# EAGLE schematic canSlaveV03_16s (EAGLE 6.3)

## Sheet 1 of 5
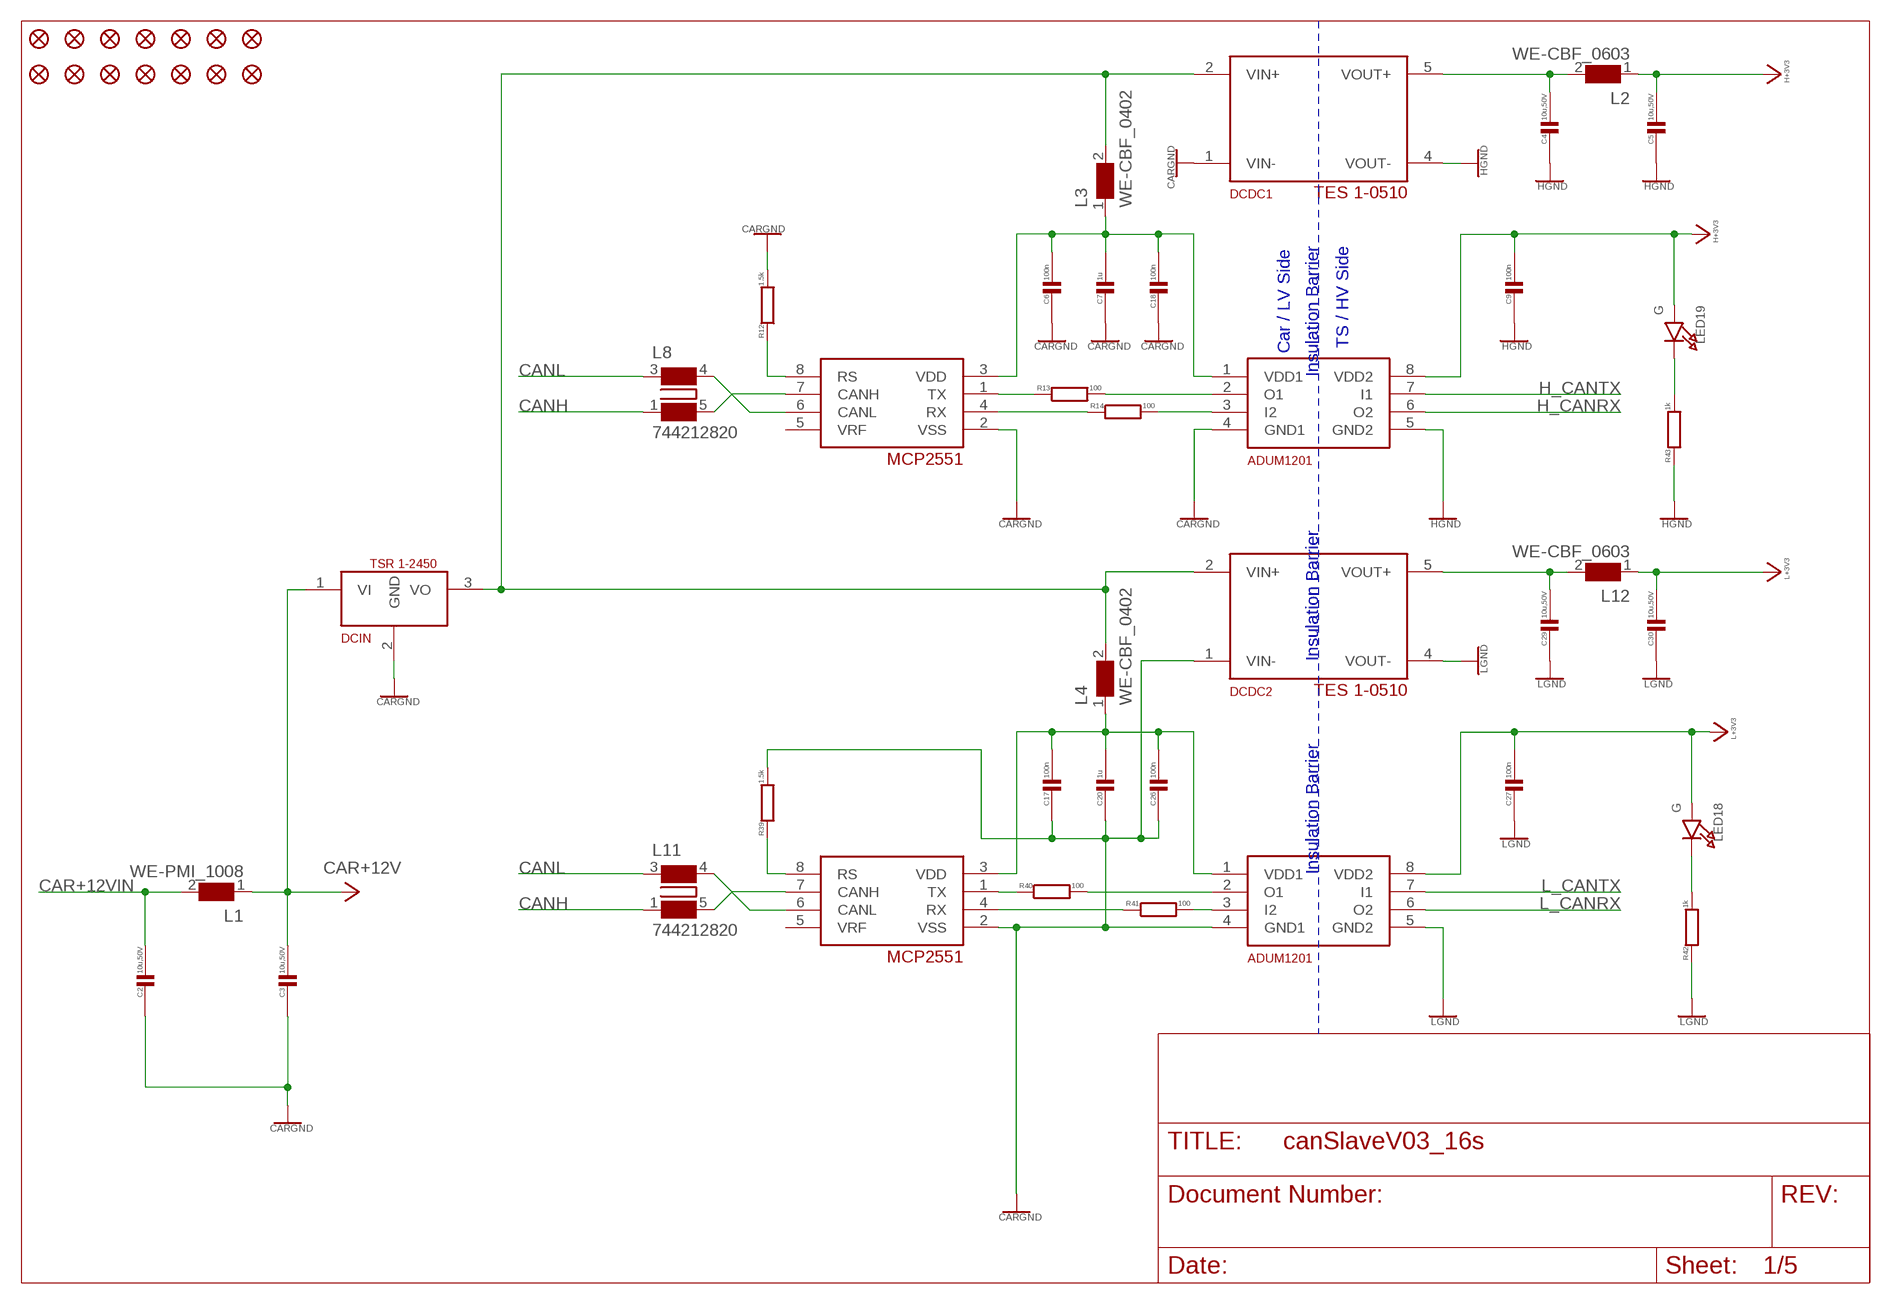
[diagram p0: schematic, sheet 1]

### Parts
C2  10u,50V  C0603  [C0603]
C3  10u,50V  C0603  [C0603]
C4  10u,50V  C0603  [C0603]
C5  10u,50V  C0603  [C0603]
C6  100n  C0402  [C0402]
C7  1u  C0402  [C0402]
C9  100n  C0402  [C0402]
C17  100n  C0402  [C0402]
C18  100n  C0402  [C0402]
C20  1u  C0402  [C0402]
C26  100n  C0402  [C0402]
C27  100n  C0402  [C0402]
C29  10u,50V  C0603  [C0603]
C30  10u,50V  C0603  [C0603]
DCDC1  TES 1-0510  ISFXXXXA  [ISF]
DCDC2  TES 1-0510  ISFXXXXA  [ISF]
DCIN  TSR 1-2450  TSR1  [TSR1]
FID1  FIDUCIAL""  [FIDUCIAL_1MM]
FID2  FIDUCIAL""  [FIDUCIAL_1MM]
FID3  FIDUCIAL""  [FIDUCIAL_1MM]
FID4  FIDUCIAL""  [FIDUCIAL_1MM]
FID5  FIDUCIAL""  [FIDUCIAL_1MM]
FID6  FIDUCIAL""  [FIDUCIAL_1MM]
FID7  FIDUCIAL""  [FIDUCIAL_1MM]
FID8  FIDUCIAL""  [FIDUCIAL_1MM]
FID9  FIDUCIAL""  [FIDUCIAL_1MM]
FID10  FIDUCIAL""  [FIDUCIAL_1MM]
FID11  FIDUCIAL""  [FIDUCIAL_1MM]
FID12  FIDUCIAL""  [FIDUCIAL_1MM]
FID13  FIDUCIAL""  [FIDUCIAL_1MM]
FID14  FIDUCIAL""  [FIDUCIAL_1MM]
IC3  ADUM1201  [SO-8]
IC4  MCP2551  [SO-8]
IC5  MCP2551  [SO-8]
IC6  ADUM1201  [SO-8]
L1  WE-PMI_1008  [WE-PMI_1008]
L2  WE-CBF_0603  [0603]
L3  WE-CBF_0402  [0402]
L4  WE-CBF_0402  [0402]
L8  744212820  WE-SL1  [WE-SL1]
L11  744212820  WE-SL1  [WE-SL1]
L12  WE-CBF_0603  [0603]
LED18  G  LED0603  [CHIPLED_0603]
LED19  G  LED0603  [CHIPLED_0603]
R12  1.5k  R0402  [R0402]
R13  100  R0402  [R0402]
R14  100  R0402  [R0402]
R39  1.5k  R0402  [R0402]
R40  100  R0402  [R0402]
R41  100  R0402  [R0402]
R42  1k  R0603  [R0603]
R43  1k  R0603  [R0603]

### Nets
+3V3DCOUT: C4.1 DCDC1.5(VOUT+) L2.2
+3V3DCOUT1: C29.1 DCDC2.5(VOUT+) L12.2
CANH: L8.1 L11.1 ; also sheet 5
CANL: L8.3 L11.3 ; also sheet 5
CAR+5V: DCDC1.2(VIN+) DCDC2.2(VIN+) DCIN.3(VO) L3.2 L4.2
CAR+5V_H: C6.1 C7.1 C18.1 IC3.1(VDD1) IC4.3(VDD) L3.1
CAR+5V_LFILT: C17.1 C20.1 C26.1 IC5.3(VDD) IC6.1(VDD1) L4.1
CAR+12V: C3.1 DCIN.1(VI) L1.1
CAR+12VIN: C2.1 L1.2 ; also sheet 5
CARGND: C2.2 C3.2 C6.2 C7.2 C17.2 C18.2 C20.2 C26.2 DCDC1.1(VIN-) DCDC2.1(VIN-) DCIN.2(GND) IC3.4(GND1) IC4.2(VSS) IC5.2(VSS) IC6.4(GND1) R12.2 R39.2 ; also sheet 5
H+3V3: C5.1 C9.1 IC3.8(VDD2) L2.1 LED19.A ; also sheet 2,3,5
H_CANRX: IC3.6(O2) ; also sheet 2
H_CANTX: IC3.7(I1) ; also sheet 2
H_CAR_CANRX: IC3.3(I2) R14.2
H_CAR_CANRX_T: IC4.4(RX) R14.1
H_CAR_CANTX: IC3.2(O1) R13.2
H_CAR_CANTX_T: IC4.1(TX) R13.1
HCANHL: IC4.7(CANH) L8.5
HCANLL: IC4.6(CANL) L8.4
HGND: C4.2 C5.2 C9.2 DCDC1.4(VOUT-) IC3.5(GND2) R43.1 ; also sheet 2,3,5
L+3V3: C27.1 C30.1 IC6.8(VDD2) L12.1 LED18.A ; also sheet 2,3,5
L_CANRX: IC6.6(O2) ; also sheet 2
L_CANTX: IC6.7(I1) ; also sheet 2
L_CAR_CANRX: IC6.3(I2) R41.2
L_CAR_CANRX_T: IC5.4(RX) R41.1
L_CAR_CANTX: IC6.2(O1) R40.2
L_CAR_CANTX_T: IC5.1(TX) R40.1
LCANHL: IC5.7(CANH) L11.5
LCANLL: IC5.6(CANL) L11.4
LGND: C27.2 C29.2 C30.2 DCDC2.4(VOUT-) IC6.5(GND2) R42.1 ; also sheet 2,3,5
N$1: LED19.C R43.2
N$2: LED18.C R42.2
RS: IC4.8(RS) R12.1
RS1: IC5.8(RS) R39.1
Unconnected: IC4.5(VRF) IC5.5(VRF)

### Buses
B$1

### Notes on the sheet
- TS / HV Side
- Car / LV Side
- Insulation Barrier
- Insulation Barrier
- Insulation Barrier

## Sheet 2 of 5
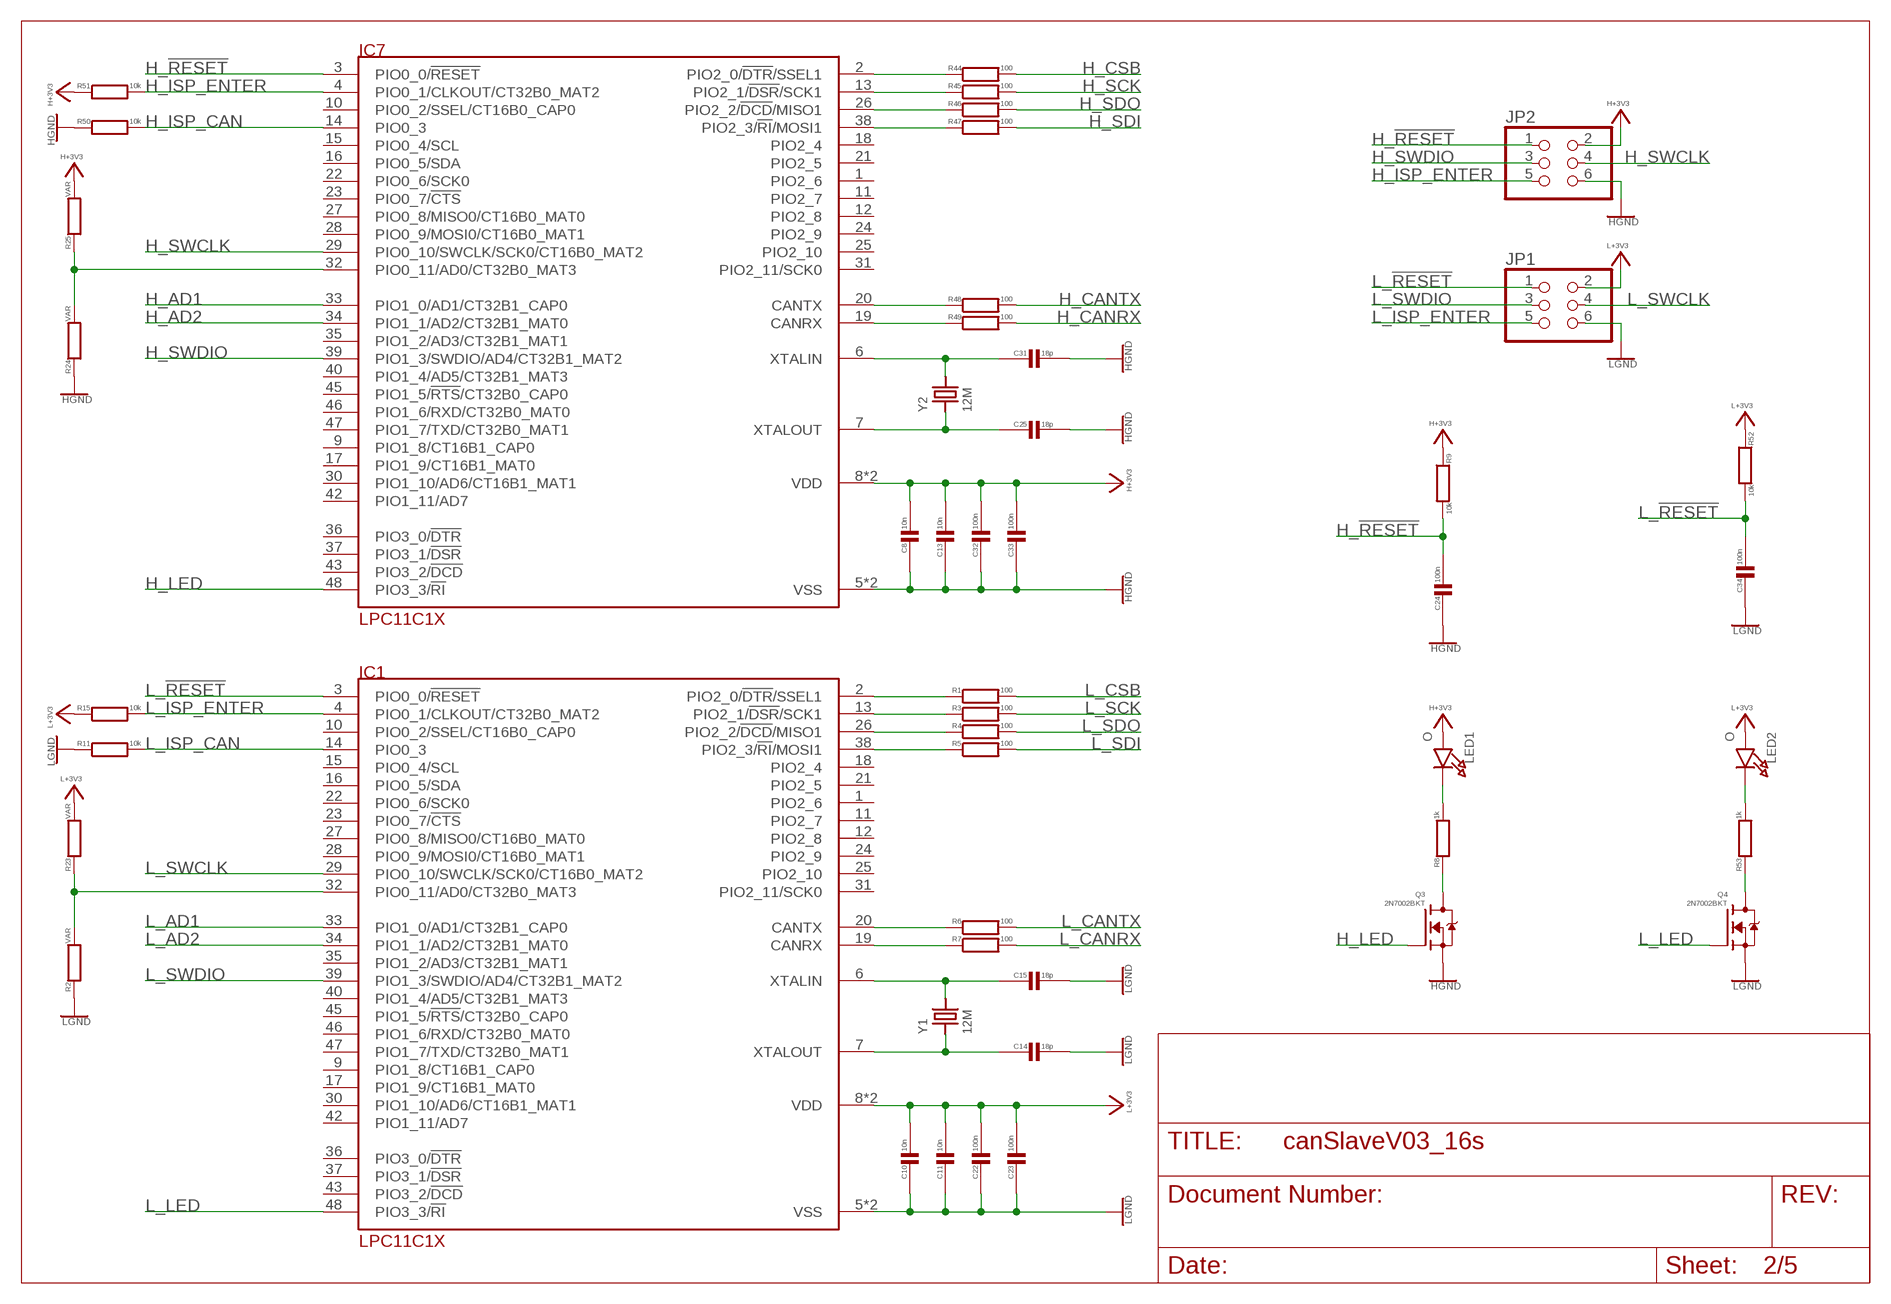
[diagram p1: schematic, sheet 2]

### Parts
C8  10n  C0402  [C0402]
C10  10n  C0402  [C0402]
C11  10n  C0402  [C0402]
C13  10n  C0402  [C0402]
C14  18p  C0402  [C0402]
C15  18p  C0402  [C0402]
C22  100n  C0402  [C0402]
C23  100n  C0402  [C0402]
C24  100n  C0402  [C0402]
C25  18p  C0402  [C0402]
C31  18p  C0402  [C0402]
C32  100n  C0402  [C0402]
C33  100n  C0402  [C0402]
C34  100n  C0402  [C0402]
IC1  LPC11C1X  [LQFP48]
IC7  LPC11C1X  [LQFP48]
JP1  HEADER-2X31.27  [2X03_1.27MM_SMT]
JP2  HEADER-2X31.27  [2X03_1.27MM_SMT]
LED1  O  LED0603  [CHIPLED_0603]
LED2  O  LED0603  [CHIPLED_0603]
Q3  2N7002BKT  [SOT416]
Q4  2N7002BKT  [SOT416]
R1  100  R0402  [R0402]
R2  VAR  R0402  [R0402]
R3  100  R0402  [R0402]
R4  100  R0402  [R0402]
R5  100  R0402  [R0402]
R6  100  R0402  [R0402]
R7  100  R0402  [R0402]
R8  1k  R0603  [R0603]
R9  10k  R0402  [R0402]
R11  10k  R0402  [R0402]
R15  10k  R0402  [R0402]
R23  VAR  R0402  [R0402]
R24  VAR  R0402  [R0402]
R25  VAR  R0402  [R0402]
R44  100  R0402  [R0402]
R45  100  R0402  [R0402]
R46  100  R0402  [R0402]
R47  100  R0402  [R0402]
R48  100  R0402  [R0402]
R49  100  R0402  [R0402]
R50  10k  R0402  [R0402]
R51  10k  R0402  [R0402]
R52  10k  R0402  [R0402]
R53  1k  R0603  [R0603]
Y1  12M  CRYSTALTHIN  [CRYSTAL_3.2X2.5]
Y2  12M  CRYSTALTHIN  [CRYSTAL_3.2X2.5]

### Nets
CANRX_U_H: IC7.19(CANRX) R49.1
CANRX_U_L: IC1.19(CANRX) R7.1
CANTX_U_H: IC7.20(CANTX) R48.1
CANTX_U_L: IC1.20(CANTX) R6.1
H+3V3: C8.1 C13.1 C32.1 C33.1 IC7.8(VDD) IC7.44(VDD) JP2.2 LED1.A R9.1 R25.2 R51.1 ; also sheet 1,3,5
H_!RESET: C24.1 IC7.3(PIO0_0/!RESET) JP2.1 R9.2
H_AD1: IC7.33(PIO1_0/AD1/CT32B1_CAP0) ; also sheet 5
H_AD2: IC7.34(PIO1_1/AD2/CT32B1_MAT0) ; also sheet 5
H_ADR: IC7.32(PIO0_11/AD0/CT32B0_MAT3) R24.2 R25.1
H_CANRX: R49.2 ; also sheet 1
H_CANTX: R48.2 ; also sheet 1
H_CSB: R44.2 ; also sheet 3
H_ISP_CAN: IC7.14(PIO0_3) R50.2
H_ISP_ENTER: IC7.4(PIO0_1/CLKOUT/CT32B0_MAT2) JP2.5 R51.2
H_LED: IC7.48(PIO3_3/!RI) Q3.1(G)
H_MISO: IC7.26(PIO2_2/!DCD!/MISO1) R46.1
H_MOSI: IC7.38(PIO2_3/!RI!/MOSI1) R47.1
H_SCK: R45.2 ; also sheet 3
H_SCK1: IC7.13(PIO2_1/!DSR!/SCK1) R45.1
H_SDI: R47.2 ; also sheet 3
H_SDO: R46.2 ; also sheet 3
H_SSEL: IC7.2(PIO2_0/!DTR!/SSEL1) R44.1
H_SWCLK: IC7.29(PIO0_10/SWCLK/SCK0/CT16B0_MAT2) JP2.4
H_SWDIO: IC7.39(PIO1_3/SWDIO/AD4/CT32B1_MAT2) JP2.3
HGND: C8.2 C13.2 C24.2 C25.1 C31.1 C32.2 C33.2 IC7.5(VSS) IC7.41(VSS) JP2.6 Q3.2(S) R24.1 R50.1 ; also sheet 1,3,5
L+3V3: C10.1 C11.1 C22.1 C23.1 IC1.8(VDD) IC1.44(VDD) JP1.2 LED2.A R15.1 R23.2 R52.1 ; also sheet 1,3,5
L_!RESET: C34.1 IC1.3(PIO0_0/!RESET) JP1.1 R52.2
L_AD1: IC1.33(PIO1_0/AD1/CT32B1_CAP0) ; also sheet 5
L_AD2: IC1.34(PIO1_1/AD2/CT32B1_MAT0) ; also sheet 5
L_ADR: IC1.32(PIO0_11/AD0/CT32B0_MAT3) R2.2 R23.1
L_CANRX: R7.2 ; also sheet 1
L_CANTX: R6.2 ; also sheet 1
L_CSB: R1.2 ; also sheet 3
L_ISP_CAN: IC1.14(PIO0_3) R11.2
L_ISP_ENTER: IC1.4(PIO0_1/CLKOUT/CT32B0_MAT2) JP1.5 R15.2
L_LED: IC1.48(PIO3_3/!RI) Q4.1(G)
L_MISO: IC1.26(PIO2_2/!DCD!/MISO1) R4.1
L_MOSI: IC1.38(PIO2_3/!RI!/MOSI1) R5.1
L_SCK: R3.2 ; also sheet 3
L_SCK1: IC1.13(PIO2_1/!DSR!/SCK1) R3.1
L_SDI: R5.2 ; also sheet 3
L_SDO: R4.2 ; also sheet 3
L_SSEL: IC1.2(PIO2_0/!DTR!/SSEL1) R1.1
L_SWCLK: IC1.29(PIO0_10/SWCLK/SCK0/CT16B0_MAT2) JP1.4
L_SWDIO: IC1.39(PIO1_3/SWDIO/AD4/CT32B1_MAT2) JP1.3
LED1C1: LED1.C R8.2
LED1C2: LED2.C R53.2
LGND: C10.2 C11.2 C14.1 C15.1 C22.2 C23.2 C34.2 IC1.5(VSS) IC1.41(VSS) JP1.6 Q4.2(S) R2.1 R11.1 ; also sheet 1,3,5
Q3_COL: Q3.3(D) R8.1
Q3_COL1: Q4.3(D) R53.1
XTALIN: C15.2 IC1.6(XTALIN) Y1.2
XTALIN1: C31.2 IC7.6(XTALIN) Y2.2
XTALOUT: C14.2 IC1.7(XTALOUT) Y1.1
XTALOUT1: C25.2 IC7.7(XTALOUT) Y2.1
Unconnected: IC1.1(PIO2_6) IC1.9(PIO1_8/CT16B1_CAP0) IC1.10(PIO0_2/SSEL/CT16B0_CAP0) IC1.11(PIO2_7) IC1.12(PIO2_8) IC1.15(PIO0_4/SCL) IC1.16(PIO0_5/SDA) IC1.17(PIO1_9/CT16B1_MAT0) IC1.18(PIO2_4) IC1.21(PIO2_5) IC1.22(PIO0_6/SCK0) IC1.23(PIO0_7/!CTS) IC1.24(PIO2_9) IC1.25(PIO2_10) IC1.27(PIO0_8/MISO0/CT16B0_MAT0) IC1.28(PIO0_9/MOSI0/CT16B0_MAT1) IC1.30(PIO1_10/AD6/CT16B1_MAT1) IC1.31(PIO2_11/SCK0) IC1.35(PIO1_2/AD3/CT32B1_MAT1) IC1.36(PIO3_0/!DTR) IC1.37(PIO3_1/!DSR) IC1.40(PIO1_4/AD5/CT32B1_MAT3) IC1.42(PIO1_11/AD7) IC1.43(PIO3_2/!DCD) IC1.45(PIO1_5/!RTS!/CT32B0_CAP0) IC1.46(PIO1_6/RXD/CT32B0_MAT0) IC1.47(PIO1_7/TXD/CT32B0_MAT1) IC7.1(PIO2_6) IC7.9(PIO1_8/CT16B1_CAP0) IC7.10(PIO0_2/SSEL/CT16B0_CAP0) IC7.11(PIO2_7) IC7.12(PIO2_8) IC7.15(PIO0_4/SCL) IC7.16(PIO0_5/SDA) IC7.17(PIO1_9/CT16B1_MAT0) IC7.18(PIO2_4) IC7.21(PIO2_5) IC7.22(PIO0_6/SCK0) IC7.23(PIO0_7/!CTS) IC7.24(PIO2_9) IC7.25(PIO2_10) IC7.27(PIO0_8/MISO0/CT16B0_MAT0) IC7.28(PIO0_9/MOSI0/CT16B0_MAT1) IC7.30(PIO1_10/AD6/CT16B1_MAT1) IC7.31(PIO2_11/SCK0) IC7.35(PIO1_2/AD3/CT32B1_MAT1) IC7.36(PIO3_0/!DTR) IC7.37(PIO3_1/!DSR) IC7.40(PIO1_4/AD5/CT32B1_MAT3) IC7.42(PIO1_11/AD7) IC7.43(PIO3_2/!DCD) IC7.45(PIO1_5/!RTS!/CT32B0_CAP0) IC7.46(PIO1_6/RXD/CT32B0_MAT0) IC7.47(PIO1_7/TXD/CT32B0_MAT1)

## Sheet 3 of 5
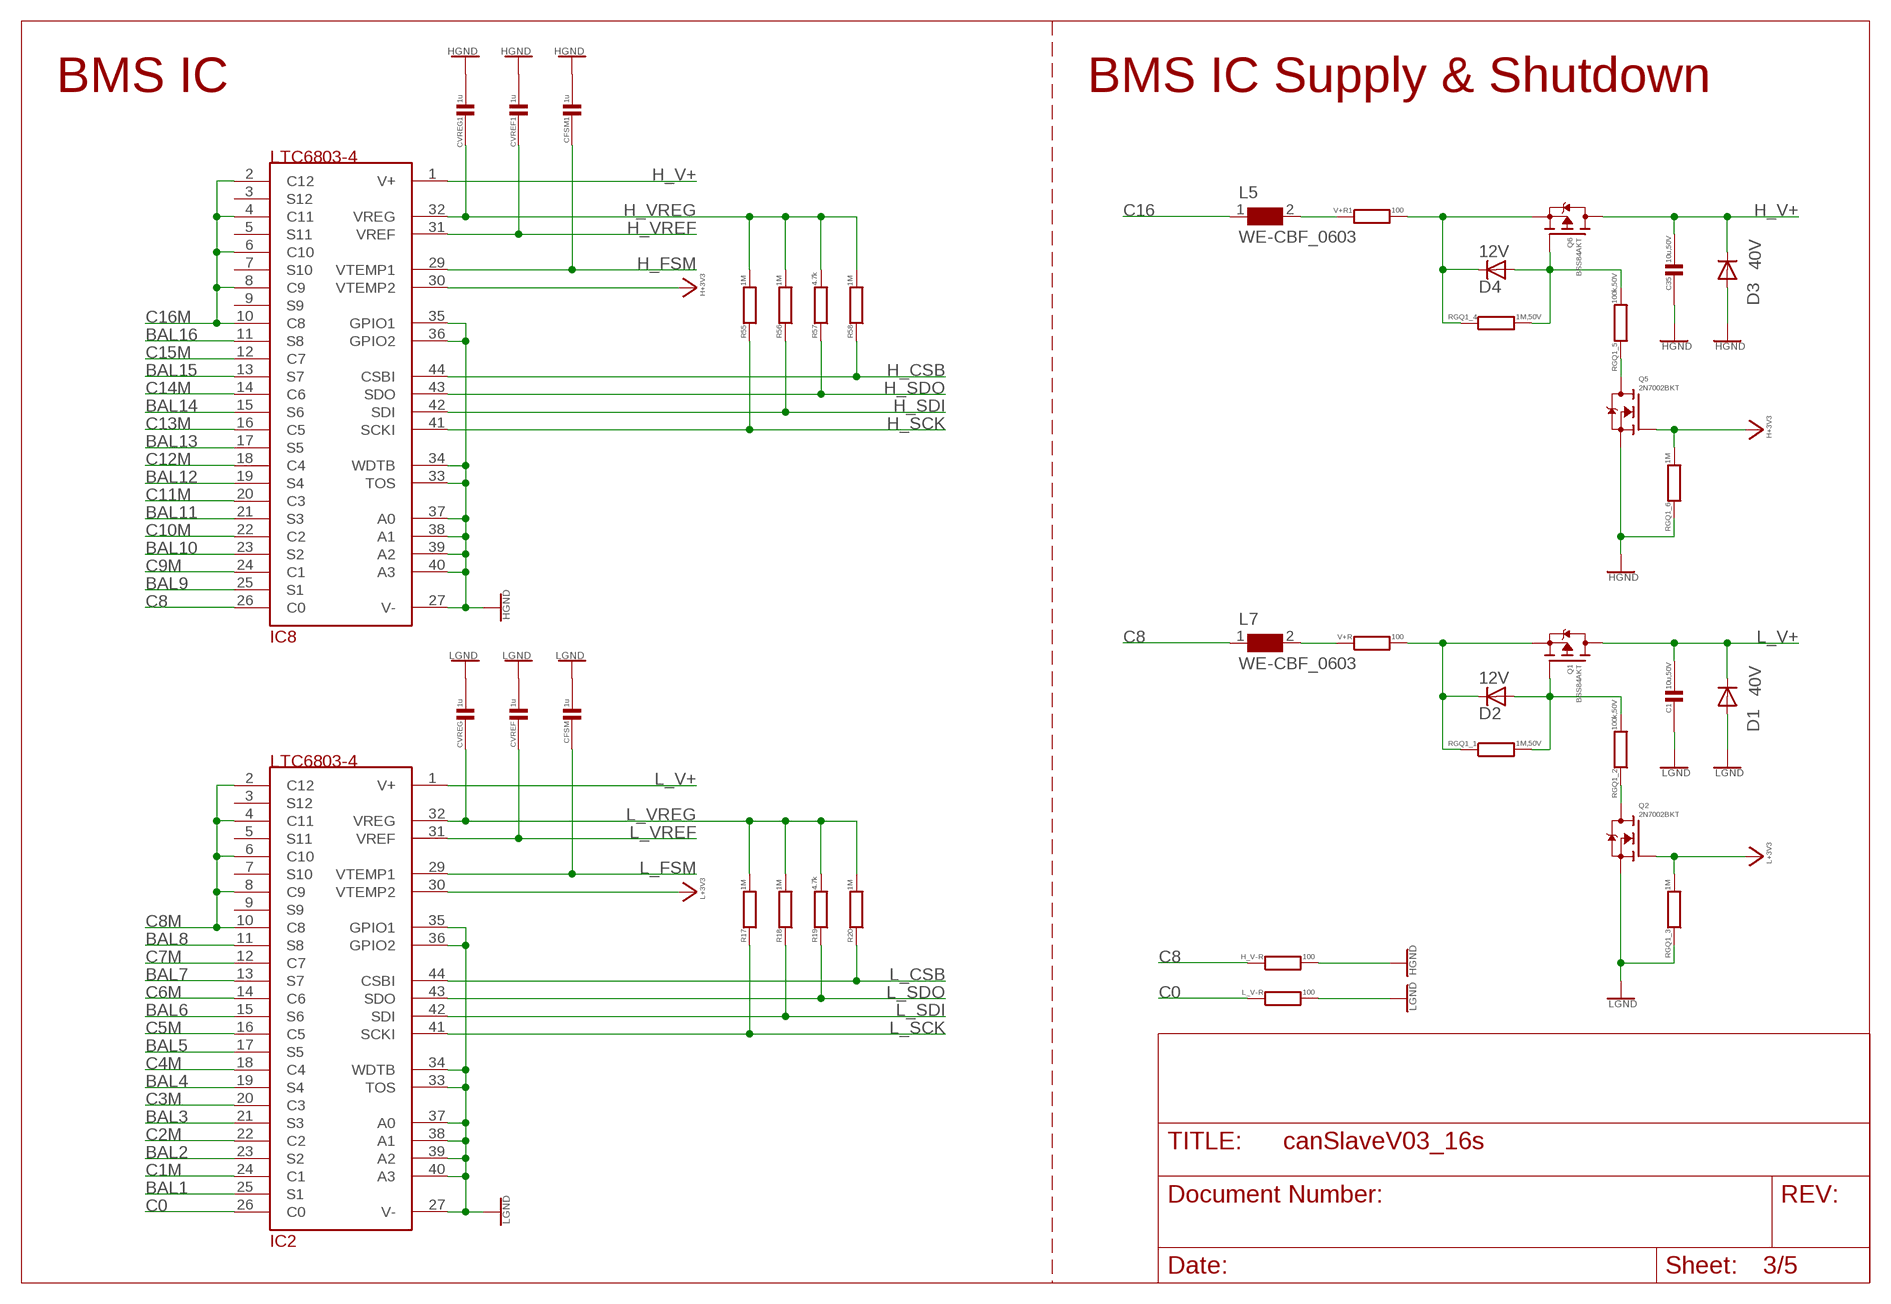
[diagram p2: schematic, sheet 3]

### Parts
C1  10u,50V  C1206  [C1206]
C35  10u,50V  C1206  [C1206]
CFSM  1u  C0402  [C0402]
CFSM1  1u  C0402  [C0402]
CVREF  1u  C0402  [C0402]
CVREF1  1u  C0402  [C0402]
CVREG  1u  C0402  [C0402]
CVREG1  1u  C0402  [C0402]
D1  40V  DIODE-SOD323-R  [SOD323-R]
D2  12V  DIODE-SOD323-R  [SOD323-R]
D3  40V  DIODE-SOD323-R  [SOD323-R]
D4  12V  DIODE-SOD323-R  [SOD323-R]
H_V-R  100  R0402  [R0402]
IC2  LTC6803-4  [44SSOP]
IC8  LTC6803-4  [44SSOP]
L5  WE-CBF_0603  [0603]
L7  WE-CBF_0603  [0603]
L_V-R  100  R0402  [R0402]
Q1  BSS84AKT  [SOT416]
Q2  2N7002BKT  [SOT416]
Q5  2N7002BKT  [SOT416]
Q6  BSS84AKT  [SOT416]
R17  1M  R0402  [R0402]
R18  1M  R0402  [R0402]
R19  4.7k  R0402  [R0402]
R20  1M  R0402  [R0402]
R55  1M  R0402  [R0402]
R56  1M  R0402  [R0402]
R57  4.7k  R0402  [R0402]
R58  1M  R0402  [R0402]
RGQ1_1  1M,50V  R0603  [R0603]
RGQ1_2  100k,50V  R0603  [R0603]
RGQ1_3  1M  R0402  [R0402]
RGQ1_4  1M,50V  R0603  [R0603]
RGQ1_5  100k,50V  R0603  [R0603]
RGQ1_6  1M  R0402  [R0402]
V+R  100  R0402  [R0402]
V+R1  100  R0402  [R0402]

### Nets
BAL1: IC2.25(S1) ; also sheet 4
BAL2: IC2.23(S2) ; also sheet 4
BAL3: IC2.21(S3) ; also sheet 4
BAL4: IC2.19(S4) ; also sheet 4
BAL5: IC2.17(S5) ; also sheet 4
BAL6: IC2.15(S6) ; also sheet 4
BAL7: IC2.13(S7) ; also sheet 4
BAL8: IC2.11(S8) ; also sheet 4
BAL9: IC8.25(S1) ; also sheet 4
BAL10: IC8.23(S2) ; also sheet 4
BAL11: IC8.21(S3) ; also sheet 4
BAL12: IC8.19(S4) ; also sheet 4
BAL13: IC8.17(S5) ; also sheet 4
BAL14: IC8.15(S6) ; also sheet 4
BAL15: IC8.13(S7) ; also sheet 4
BAL16: IC8.11(S8) ; also sheet 4
C0: IC2.26(C0) L_V-R.1 ; also sheet 4,5
C1M: IC2.24(C1) ; also sheet 4
C2M: IC2.22(C2) ; also sheet 4
C3M: IC2.20(C3) ; also sheet 4
C4M: IC2.18(C4) ; also sheet 4
C5M: IC2.16(C5) ; also sheet 4
C6M: IC2.14(C6) ; also sheet 4
C7M: IC2.12(C7) ; also sheet 4
C8: H_V-R.1 IC8.26(C0) L7.1 ; also sheet 4,5
C8M: IC2.2(C12) IC2.4(C11) IC2.6(C10) IC2.8(C9) IC2.10(C8) ; also sheet 4
C9M: IC8.24(C1) ; also sheet 4
C10M: IC8.22(C2) ; also sheet 4
C11M: IC8.20(C3) ; also sheet 4
C12M: IC8.18(C4) ; also sheet 4
C13M: IC8.16(C5) ; also sheet 4
C14M: IC8.14(C6) ; also sheet 4
C15M: IC8.12(C7) ; also sheet 4
C16: L5.1 ; also sheet 4,5
C16M: IC8.2(C12) IC8.4(C11) IC8.6(C10) IC8.8(C9) IC8.10(C8) ; also sheet 4
H+3V3: IC8.30(VTEMP2) Q5.1(G) RGQ1_6.2 ; also sheet 1,2,5
H_CSB: IC8.44(CSBI) R58.1 ; also sheet 2
H_FSM: CFSM1.2 IC8.29(VTEMP1) ; also sheet 5
H_SCK: IC8.41(SCKI) R55.1 ; also sheet 2
H_SDI: IC8.42(SDI) R56.1 ; also sheet 2
H_SDO: IC8.43(SDO) R57.1 ; also sheet 2
H_V+: C35.1 D3.C IC8.1(V+) Q6.3(D) ; also sheet 5
H_VREF: CVREF1.2 IC8.31(VREF)
H_VREG: CVREG1.2 IC8.32(VREG) R55.2 R56.2 R57.2 R58.2
HGND: C35.2 CFSM1.1 CVREF1.1 CVREG1.1 D3.A H_V-R.2 IC8.27(V-) IC8.33(TOS) IC8.34(WDTB) IC8.35(GPIO1) IC8.36(GPIO2) IC8.37(A0) IC8.38(A1) IC8.39(A2) IC8.40(A3) Q5.2(S) RGQ1_6.1 ; also sheet 1,2,5
L+3V3: IC2.30(VTEMP2) Q2.1(G) RGQ1_3.2 ; also sheet 1,2,5
L_CSB: IC2.44(CSBI) R20.1 ; also sheet 2
L_FSM: CFSM.2 IC2.29(VTEMP1) ; also sheet 5
L_SCK: IC2.41(SCKI) R17.1 ; also sheet 2
L_SDI: IC2.42(SDI) R18.1 ; also sheet 2
L_SDO: IC2.43(SDO) R19.1 ; also sheet 2
L_V+: C1.1 D1.C IC2.1(V+) Q1.3(D) ; also sheet 5
L_VREF: CVREF.2 IC2.31(VREF)
L_VREG: CVREG.2 IC2.32(VREG) R17.2 R18.2 R19.2 R20.2
LGND: C1.2 CFSM.1 CVREF.1 CVREG.1 D1.A IC2.27(V-) IC2.33(TOS) IC2.34(WDTB) IC2.35(GPIO1) IC2.36(GPIO2) IC2.37(A0) IC2.38(A1) IC2.39(A2) IC2.40(A3) L_V-R.2 Q2.2(S) RGQ1_3.1 ; also sheet 1,2,5
N$3: Q2.3(D) RGQ1_2.1
N$4: L7.2 V+R.1
N$5: Q5.3(D) RGQ1_5.1
N$6: L5.2 V+R1.1
Q1G: D2.A Q1.1(G) RGQ1_1.2 RGQ1_2.2
Q1G1: D4.A Q6.1(G) RGQ1_4.2 RGQ1_5.2
V+S: D2.C Q1.2(S) RGQ1_1.1 V+R.2
V+S1: D4.C Q6.2(S) RGQ1_4.1 V+R1.2
Unconnected: IC2.3(S12) IC2.5(S11) IC2.7(S10) IC2.9(S9) IC8.3(S12) IC8.5(S11) IC8.7(S10) IC8.9(S9)

### Notes on the sheet
- BMS IC | BMS IC Supply & Shutdown

## Sheet 4 of 5
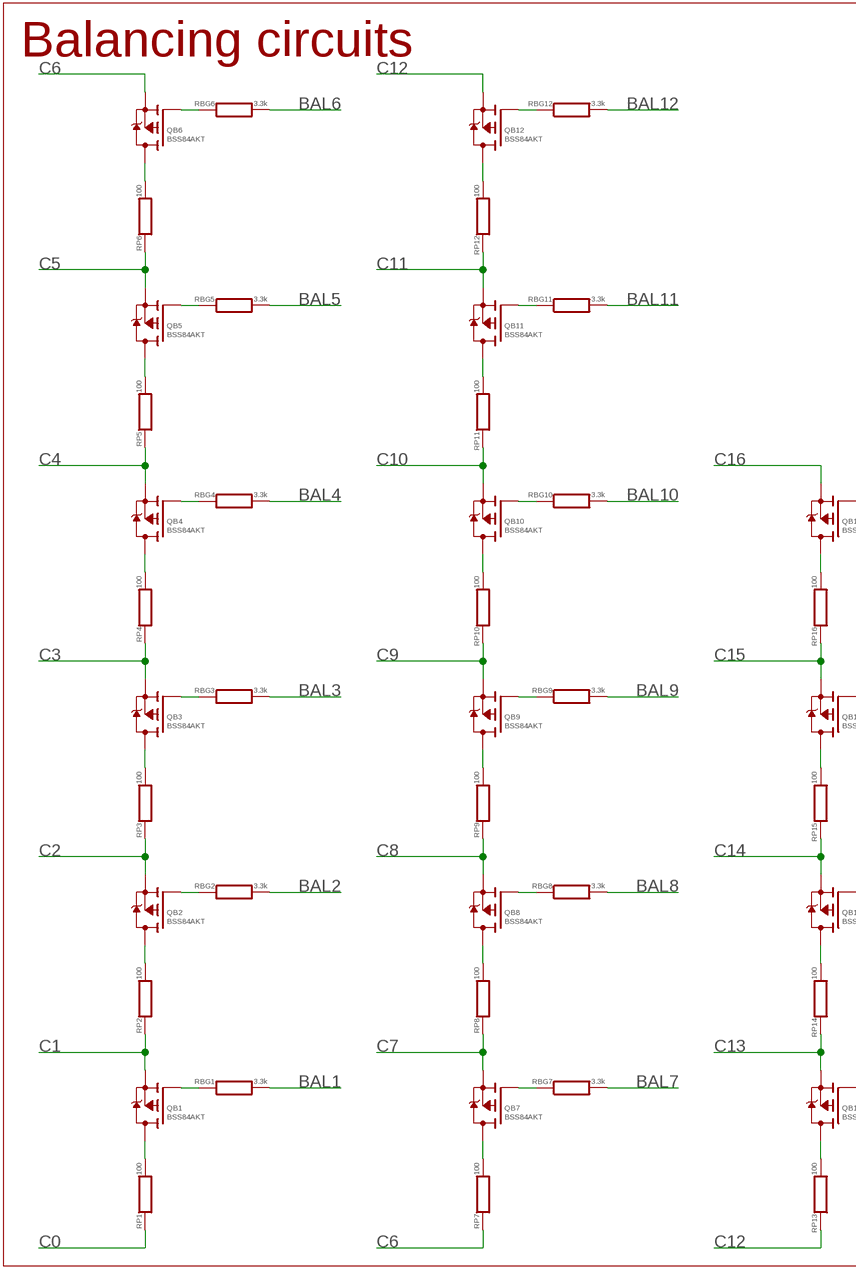
[diagram p3: schematic, sheet 4, part 1 of 2]
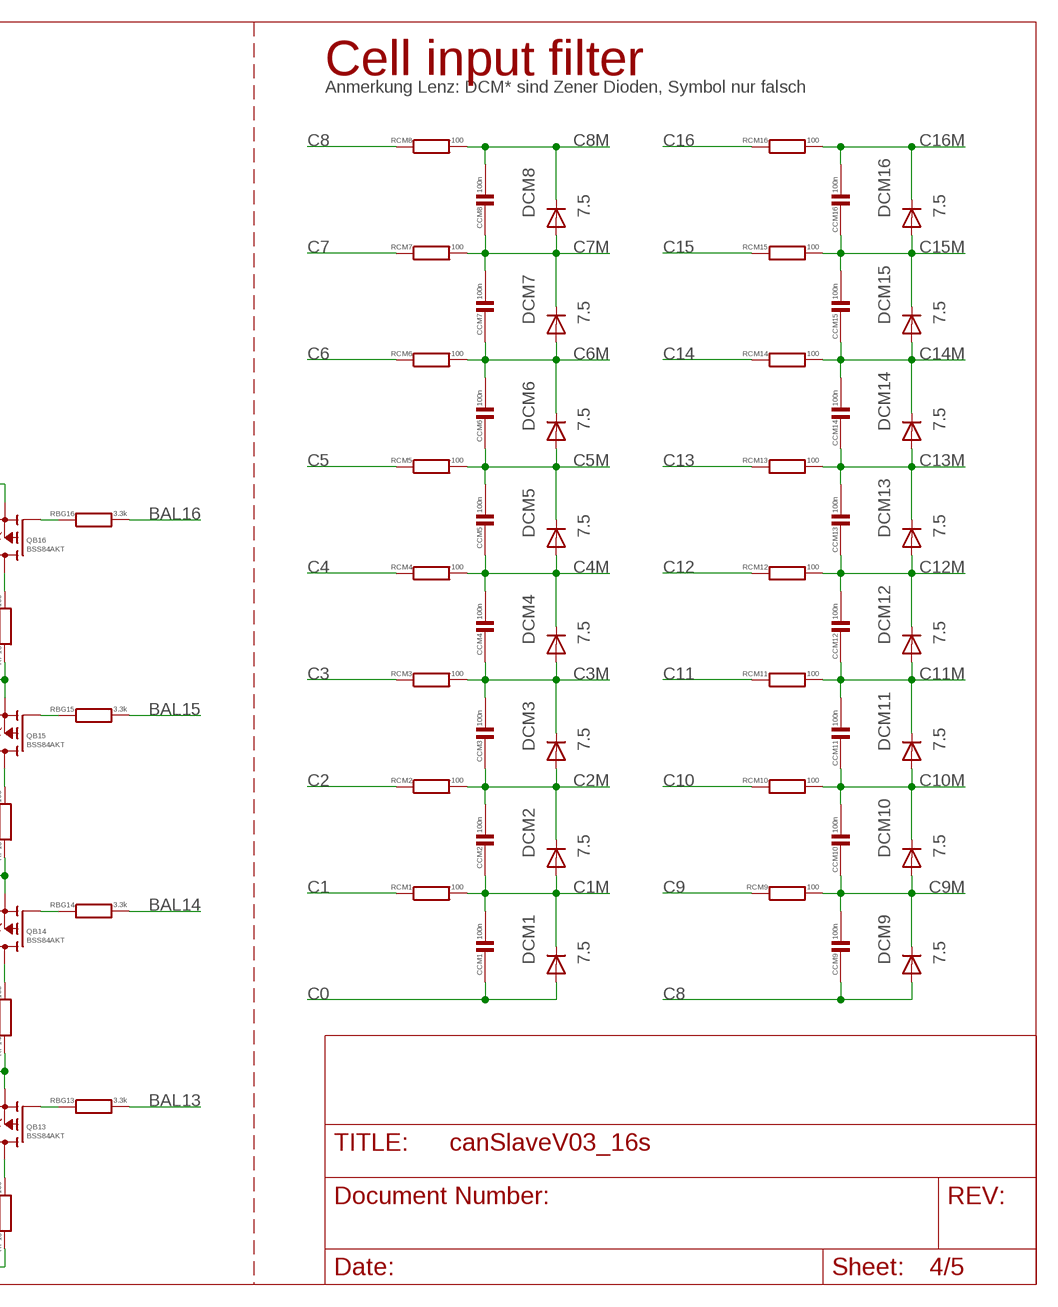
[diagram p4: schematic, sheet 4, part 2 of 2]

### Parts
CCM1  100n  C0402  [C0402]
CCM2  100n  C0402  [C0402]
CCM3  100n  C0402  [C0402]
CCM4  100n  C0402  [C0402]
CCM5  100n  C0402  [C0402]
CCM6  100n  C0402  [C0402]
CCM7  100n  C0402  [C0402]
CCM8  100n  C0402  [C0402]
CCM9  100n  C0402  [C0402]
CCM10  100n  C0402  [C0402]
CCM11  100n  C0402  [C0402]
CCM12  100n  C0402  [C0402]
CCM13  100n  C0402  [C0402]
CCM14  100n  C0402  [C0402]
CCM15  100n  C0402  [C0402]
CCM16  100n  C0402  [C0402]
DCM1  7.5  DIODE-SOD323-R  [SOD323-R]
DCM2  7.5  DIODE-SOD323-R  [SOD323-R]
DCM3  7.5  DIODE-SOD323-R  [SOD323-R]
DCM4  7.5  DIODE-SOD323-R  [SOD323-R]
DCM5  7.5  DIODE-SOD323-R  [SOD323-R]
DCM6  7.5  DIODE-SOD323-R  [SOD323-R]
DCM7  7.5  DIODE-SOD323-R  [SOD323-R]
DCM8  7.5  DIODE-SOD323-R  [SOD323-R]
DCM9  7.5  DIODE-SOD323-R  [SOD323-R]
DCM10  7.5  DIODE-SOD323-R  [SOD323-R]
DCM11  7.5  DIODE-SOD323-R  [SOD323-R]
DCM12  7.5  DIODE-SOD323-R  [SOD323-R]
DCM13  7.5  DIODE-SOD323-R  [SOD323-R]
DCM14  7.5  DIODE-SOD323-R  [SOD323-R]
DCM15  7.5  DIODE-SOD323-R  [SOD323-R]
DCM16  7.5  DIODE-SOD323-R  [SOD323-R]
QB1  BSS84AKT  [SOT416]
QB2  BSS84AKT  [SOT416]
QB3  BSS84AKT  [SOT416]
QB4  BSS84AKT  [SOT416]
QB5  BSS84AKT  [SOT416]
QB6  BSS84AKT  [SOT416]
QB7  BSS84AKT  [SOT416]
QB8  BSS84AKT  [SOT416]
QB9  BSS84AKT  [SOT416]
QB10  BSS84AKT  [SOT416]
QB11  BSS84AKT  [SOT416]
QB12  BSS84AKT  [SOT416]
QB13  BSS84AKT  [SOT416]
QB14  BSS84AKT  [SOT416]
QB15  BSS84AKT  [SOT416]
QB16  BSS84AKT  [SOT416]
RBG1  3.3k  R0402  [R0402]
RBG2  3.3k  R0402  [R0402]
RBG3  3.3k  R0402  [R0402]
RBG4  3.3k  R0402  [R0402]
RBG5  3.3k  R0402  [R0402]
RBG6  3.3k  R0402  [R0402]
RBG7  3.3k  R0402  [R0402]
RBG8  3.3k  R0402  [R0402]
RBG9  3.3k  R0402  [R0402]
RBG10  3.3k  R0402  [R0402]
RBG11  3.3k  R0402  [R0402]
RBG12  3.3k  R0402  [R0402]
RBG13  3.3k  R0402  [R0402]
RBG14  3.3k  R0402  [R0402]
RBG15  3.3k  R0402  [R0402]
RBG16  3.3k  R0402  [R0402]
RCM1  100  R0402  [R0402]
RCM2  100  R0402  [R0402]
RCM3  100  R0402  [R0402]
RCM4  100  R0402  [R0402]
RCM5  100  R0402  [R0402]
RCM6  100  R0402  [R0402]
RCM7  100  R0402  [R0402]
RCM8  100  R0402  [R0402]
RCM9  100  R0402  [R0402]
RCM10  100  R0402  [R0402]
RCM11  100  R0402  [R0402]
RCM12  100  R0402  [R0402]
RCM13  100  R0402  [R0402]
RCM14  100  R0402  [R0402]
RCM15  100  R0402  [R0402]
RCM16  100  R0402  [R0402]
RP1  100  R2512  [R2512]
RP2  100  R2512  [R2512]
RP3  100  R2512  [R2512]
RP4  100  R2512  [R2512]
RP5  100  R2512  [R2512]
RP6  100  R2512  [R2512]
RP7  100  R2512  [R2512]
RP8  100  R2512  [R2512]
RP9  100  R2512  [R2512]
RP10  100  R2512  [R2512]
RP11  100  R2512  [R2512]
RP12  100  R2512  [R2512]
RP13  100  R2512  [R2512]
RP14  100  R2512  [R2512]
RP15  100  R2512  [R2512]
RP16  100  R2512  [R2512]

### Nets
BAL1: RBG1.2 ; also sheet 3
BAL2: RBG2.2 ; also sheet 3
BAL3: RBG3.2 ; also sheet 3
BAL4: RBG4.2 ; also sheet 3
BAL5: RBG5.2 ; also sheet 3
BAL6: RBG6.2 ; also sheet 3
BAL7: RBG7.2 ; also sheet 3
BAL8: RBG8.2 ; also sheet 3
BAL9: RBG9.2 ; also sheet 3
BAL10: RBG10.2 ; also sheet 3
BAL11: RBG11.2 ; also sheet 3
BAL12: RBG12.2 ; also sheet 3
BAL13: RBG13.2 ; also sheet 3
BAL14: RBG14.2 ; also sheet 3
BAL15: RBG15.2 ; also sheet 3
BAL16: RBG16.2 ; also sheet 3
C0: CCM1.2 DCM1.A RP1.1 ; also sheet 3,5
C1: QB1.2(S) RCM1.1 RP2.1 ; also sheet 5
C1M: CCM1.1 CCM2.2 DCM1.C DCM2.A RCM1.2 ; also sheet 3
C2: QB2.2(S) RCM2.1 RP3.1 ; also sheet 5
C2M: CCM2.1 CCM3.2 DCM2.C DCM3.A RCM2.2 ; also sheet 3
C3: QB3.2(S) RCM3.1 RP4.1 ; also sheet 5
C3M: CCM3.1 CCM4.2 DCM3.C DCM4.A RCM3.2 ; also sheet 3
C4: QB4.2(S) RCM4.1 RP5.1 ; also sheet 5
C4M: CCM4.1 CCM5.2 DCM4.C DCM5.A RCM4.2 ; also sheet 3
C5: QB5.2(S) RCM5.1 RP6.1 ; also sheet 5
C5M: CCM5.1 CCM6.2 DCM5.C DCM6.A RCM5.2 ; also sheet 3
C6: QB6.2(S) RCM6.1 RP7.1 ; also sheet 5
C6M: CCM6.1 CCM7.2 DCM6.C DCM7.A RCM6.2 ; also sheet 3
C7: QB7.2(S) RCM7.1 RP8.1 ; also sheet 5
C7M: CCM7.1 CCM8.2 DCM7.C DCM8.A RCM7.2 ; also sheet 3
C8: CCM9.2 DCM9.A QB8.2(S) RCM8.1 RP9.1 ; also sheet 3,5
C8M: CCM8.1 DCM8.C RCM8.2 ; also sheet 3
C9: QB9.2(S) RCM9.1 RP10.1 ; also sheet 5
C9M: CCM9.1 CCM10.2 DCM9.C DCM10.A RCM9.2 ; also sheet 3
C10: QB10.2(S) RCM10.1 RP11.1 ; also sheet 5
C10M: CCM10.1 CCM11.2 DCM10.C DCM11.A RCM10.2 ; also sheet 3
C11: QB11.2(S) RCM11.1 RP12.1 ; also sheet 5
C11M: CCM11.1 CCM12.2 DCM11.C DCM12.A RCM11.2 ; also sheet 3
C12: QB12.2(S) RCM12.1 RP13.1 ; also sheet 5
C12M: CCM12.1 CCM13.2 DCM12.C DCM13.A RCM12.2 ; also sheet 3
C13: QB13.2(S) RCM13.1 RP14.1 ; also sheet 5
C13M: CCM13.1 CCM14.2 DCM13.C DCM14.A RCM13.2 ; also sheet 3
C14: QB14.2(S) RCM14.1 RP15.1 ; also sheet 5
C14M: CCM14.1 CCM15.2 DCM14.C DCM15.A RCM14.2 ; also sheet 3
C15: QB15.2(S) RCM15.1 RP16.1 ; also sheet 5
C15M: CCM15.1 CCM16.2 DCM15.C DCM16.A RCM15.2 ; also sheet 3
C16: QB16.2(S) RCM16.1 ; also sheet 3,5
C16M: CCM16.1 DCM16.C RCM16.2 ; also sheet 3
CR1: QB1.3(D) RP1.2
CR2: QB2.3(D) RP2.2
CR3: QB3.3(D) RP3.2
CR4: QB4.3(D) RP4.2
CR5: QB5.3(D) RP5.2
CR6: QB6.3(D) RP6.2
CR7: QB7.3(D) RP7.2
CR8: QB8.3(D) RP8.2
CR9: QB9.3(D) RP9.2
CR10: QB10.3(D) RP10.2
CR11: QB11.3(D) RP11.2
CR12: QB12.3(D) RP12.2
CR13: QB13.3(D) RP13.2
CR14: QB14.3(D) RP14.2
CR15: QB15.3(D) RP15.2
CR16: QB16.3(D) RP16.2
QBG1: QB1.1(G) RBG1.1
QBG2: QB2.1(G) RBG2.1
QBG3: QB3.1(G) RBG3.1
QBG4: QB4.1(G) RBG4.1
QBG5: QB5.1(G) RBG5.1
QBG6: QB6.1(G) RBG6.1
QBG7: QB7.1(G) RBG7.1
QBG8: QB8.1(G) RBG8.1
QBG9: QB9.1(G) RBG9.1
QBG10: QB10.1(G) RBG10.1
QBG11: QB11.1(G) RBG11.1
QBG12: QB12.1(G) RBG12.1
QBG13: QB13.1(G) RBG13.1
QBG14: QB14.1(G) RBG14.1
QBG15: QB15.1(G) RBG15.1
QBG16: QB16.1(G) RBG16.1

### Notes on the sheet
- Balancing circuits | Cell input filter
- Anmerkung Lenz: DCM* sind Zener Dioden, Symbol nur falsch

## Sheet 5 of 5
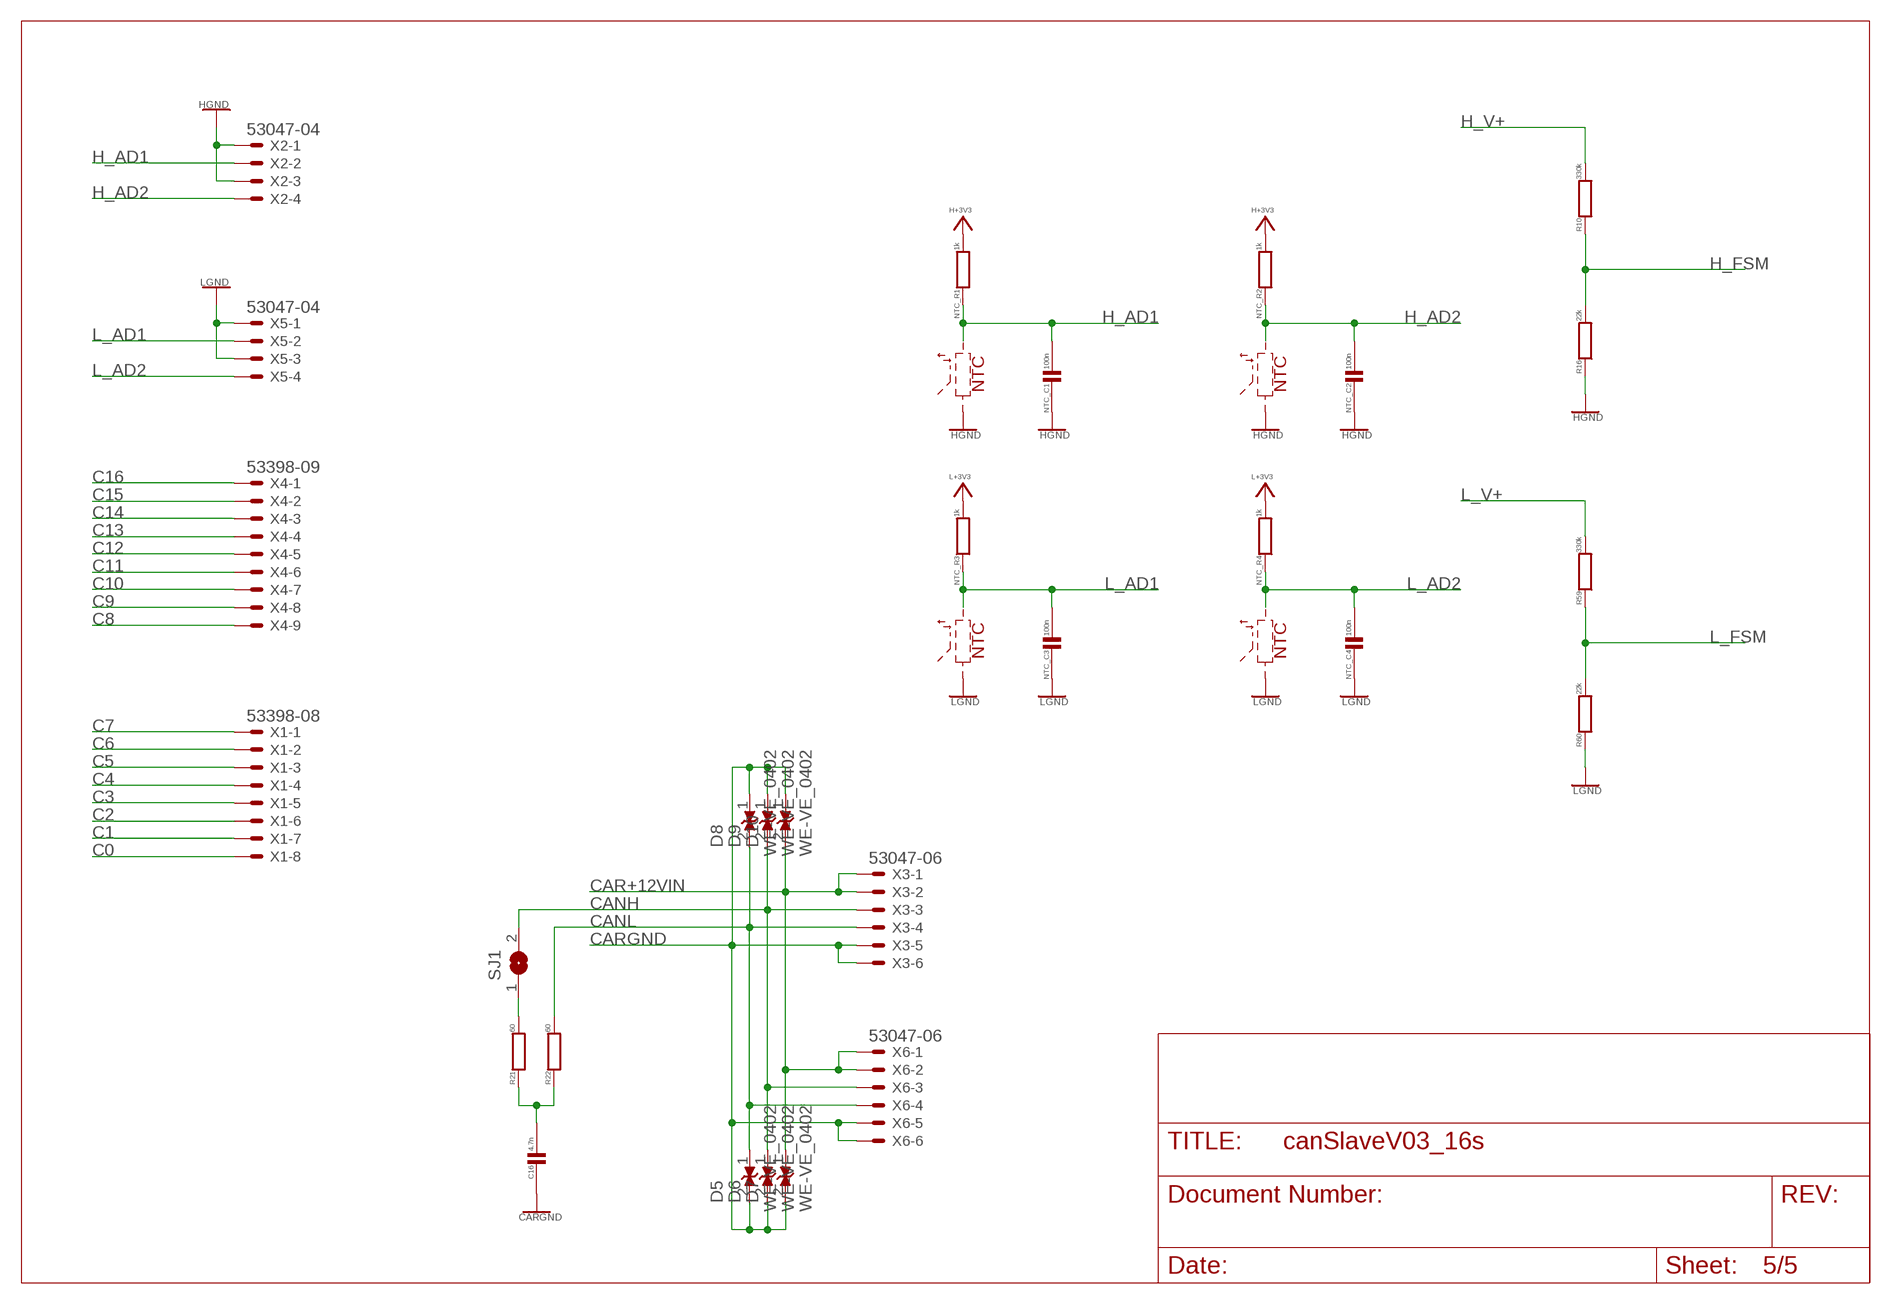
[diagram p5: schematic, sheet 5]

### Parts
C16  4.7n  C0402  [C0402]
D5  WE-VE_0402  [WESURGE_0402]
D6  WE-VE_0402  [WESURGE_0402]
D7  WE-VE_0402  [WESURGE_0402]
D8  WE-VE_0402  [WESURGE_0402]
D9  WE-VE_0402  [WESURGE_0402]
D10  WE-VE_0402  [WESURGE_0402]
NTC_C1  100n  C0402  [C0402]
NTC_C2  100n  C0402  [C0402]
NTC_C3  100n  C0402  [C0402]
NTC_C4  100n  C0402  [C0402]
NTC_R1  1k  R0402  [R0402]
NTC_R2  1k  R0402  [R0402]
NTC_R3  1k  R0402  [R0402]
NTC_R4  1k  R0402  [R0402]
R10  330k  R0603  [R0603]
R16  22k  R0603  [R0603]
R21  60  R0402  [R0402]
R22  60  R0402  [R0402]
R59  330k  R0603  [R0603]
R60  22k  R0603  [R0603]
SJ1  SOLDERJUMPERSMALL  [SOLDERJUMPER_REFLOW_NOPASTE_SMALL]
X1  53398-08  [53398-08]
X2  53047-04  [53047-04]
X3  53047-06  [53047-06]
X4  53398-09  [53398-09]
X5  53047-04  [53047-04]
X6  53047-06  [53047-06]

### Nets
C0: X1.8 ; also sheet 3,4
C1: X1.7 ; also sheet 4
C2: X1.6 ; also sheet 4
C3: X1.5 ; also sheet 4
C4: X1.4 ; also sheet 4
C5: X1.3 ; also sheet 4
C6: X1.2 ; also sheet 4
C7: X1.1 ; also sheet 4
C8: X4.9 ; also sheet 3,4
C9: X4.8 ; also sheet 4
C10: X4.7 ; also sheet 4
C11: X4.6 ; also sheet 4
C12: X4.5 ; also sheet 4
C13: X4.4 ; also sheet 4
C14: X4.3 ; also sheet 4
C15: X4.2 ; also sheet 4
C16: X4.1 ; also sheet 3,4
CANH: D6.1 D9.2 SJ1.2 X3.3 X6.3 ; also sheet 1
CANJ: R21.2 SJ1.1
CANL: D5.1 D8.2 R22.2 X3.4 X6.4 ; also sheet 1
CANT: C16.1 R21.1 R22.1
CAR+12VIN: D7.1 D10.2 X3.1 X3.2 X6.1 X6.2 ; also sheet 1
CARGND: C16.2 D5.2 D6.2 D7.2 D8.1 D9.1 D10.1 X3.5 X3.6 X6.5 X6.6 ; also sheet 1
H+3V3: NTC_R1.2 NTC_R2.2 ; also sheet 1,2,3
H_AD1: NTC_C1.1 NTC_R1.1 X2.2 ; also sheet 2
H_AD2: NTC_C2.1 NTC_R2.1 X2.4 ; also sheet 2
H_FSM: R10.1 R16.2 ; also sheet 3
H_V+: R10.2 ; also sheet 3
HGND: NTC_C1.2 NTC_C2.2 R16.1 X2.1 X2.3 ; also sheet 1,2,3
L+3V3: NTC_R3.2 NTC_R4.2 ; also sheet 1,2,3
L_AD1: NTC_C3.1 NTC_R3.1 X5.2 ; also sheet 2
L_AD2: NTC_C4.1 NTC_R4.1 X5.4 ; also sheet 2
L_FSM: R59.1 R60.2 ; also sheet 3
L_V+: R59.2 ; also sheet 3
LGND: NTC_C3.2 NTC_C4.2 R60.1 X5.1 X5.3 ; also sheet 1,2,3

### Notes on the sheet
- NTC | NTC
- NTC | NTC

## Library data of the parts
C1-C11 C13-C18 C20 C22-C27 C29-C35 CCM1-CCM16 CFSM CFSM1 CVREF CVREF1 CVREG CVREG1 NTC_C1-NTC_C4 = phrenetic:C
D1-D4 DCM1-DCM16 = diode:DIODE-: DIODE
D5-D10 = EagleLibrary_Wuerth_Elektronik_eiSos_Version_6:WE-VE: WESURGE ESD Suppressor WE-VE - Fast response time - No leakage current - Low clamping voltage - Almost no energy consumption in stand-by mode - Excellent absorption for ESD-impulses - Designed to meet the EN 61000-4-2 standard - Nickel barrier - Operating temperature: -40°C to +85°C -- Protection of data lines -- Protection of bus system -- Protection of semiconductors -- ESD protection in accordance with EN 61000-4-2; 8 kV contact discharge / 15 kV air discharge
DCDC1 DCDC2 = bms-hsrm:ISFXXXXA
DCIN = bms-hsrm:TSR1
FID1-FID14 = microbuilder:FIDUCIAL: Fiducial Alignment Points Various fiducial points for machine vision alignment.
H_V-R L_V-R NTC_R1-NTC_R4 R1-R25 R39-R53 R55-R60 RBG1-RBG16 RCM1-RCM16 RGQ1_1-RGQ1_6 RP1-RP16 V+R V+R1 = phrenetic:R: RESISTOR, Bla
IC1 IC7 = phrenetic:LPC11C1X
IC2 IC8 = bms-hsrm:LTC6803-4
IC3 IC6 = bms-hsrm:ADUM1201
IC4 IC5 = bms-hsrm:MCP2551
JP1 JP2 = microbuilder:HEADER-2X3: PIN HEADER
L1 = EagleLibrary_Wuerth_Elektronik_eiSos_Version_6:WE-PMI: Power Multilayer Inductor WE-PMI - Compact multilayer type - Suitable for applocations with high currents up to 2.5 A - No crosstalk -- DC / DC converters especially at high switching frequencies -- Portable devices like PDA and digital cameras
L2-L5 L7 L12 = EagleLibrary_Wuerth_Elektronik_eiSos_Version_6:WE-CBF: SMD EMI Suppression Ferrite Beads WE-CBF - Excellent anti-EMI properties - Low DC-restistance - Impedances till 3000 ohms - Rated current up to 6 A -- Reliable Ni-Sn electrodes -- Perfect as data lined filter and for uncoupling of distribution voltage
L8 L11 = EagleLibrary_Wuerth_Elektronik_eiSos_Version_6:WE-SL1: SMD Common Mode Line Filter WE-SL1 - Small size - Low Profile, only 1,65 mm - High Impedance up to 2000 ohm - High Current up to 300mA - Low leakage inductance -- USB -- CAN -- Firewire -- Data Lines -- Power Lines
LED1 LED2 LED18 LED19 = microbuilder:LED: LED 0603 - 0603 Surface Mount Package 2mA: Green LED - Low Power (3.9mcd, 2ma, 1.7Vf) - Digikey: 475-2709-2-ND Orange LED - Low Power (9.8mcd, 2ma, 1.8Vf) - Digikey: 475-1194-2-ND Red LED - Low Power (5mcd, 2ma, 1.8Vf) - Digikey: 475-1195-2-ND Yellow LED - Low Power (7mcd, 2ma, 1.8Vf) - Digikey: 475-1196-2-ND 5mA: Blue LED - Low Power (17mcd, 5ma, 2.9Vf) - Digikey: LNJ937W8CRACT-ND 0805 - 0805 Surface Mount Package 2mA: Red LED (8.8mcd, 2mA, 1.8Vf, Clear) - Low Power [Digikey: 475-2510-1-ND] Green LED (5mcd, 2mA, 1.8Vf, Clear) - Low Power [Digikey: 475-2730-1-ND] Yellow LED (11.3mcd, 2mA, 1.8Vf, Clear) - Low Power [Digikey: 475-2555-1-ND] 20mA: Red LED (104mcd, 20mA, Diffused) - LS R976 [Digikey: 475-1278-6-ND] Red LED (12mcd, 20mA, 2.0Vf, Clear) - APT2012EC [Digikey: 754-1128-1-ND] Green LED (15mcd, 20mA, 2.2Vf, Clear) - APT2012GC [Digikey: 754-1131-1-ND] Orange LED (160mcd, 20mA, 2.1Vf, Clear) - APT2012SECK [Digikey: 754-1130-1-ND] 1206 - 1206 Surface Mount Package Green LED (26mcd, 20mA, Diffused) - LG N971 [Digikey: 475-1407-6-ND] Red LED (15mcd, 20mA, Diffused) - LH N974 [Digikey: 475-1416-6-ND]
Q1 Q6 QB1-QB16 = phrenetic:BSS84
Q2-Q5 = phrenetic:2N7002
SJ1 = microbuilder:SOLDERJUMPER: SMD Solder JUMPER Solder the two pads together to create a connection, or remove the solder to break it. REFLOW - Use this footprint for solder paste and reflow ovens. WAVE - Use this footprint for hand-soldering (larger pads). CLOSED - Has a trace between the two pads to ensure it is closed by default. The trace needs to be cut to disable the jumper, and can be closed again by creating a solder bridge between the two pads.
X1 = con-molex:53?-08: CONNECTOR wire to board 1.25 mm (.049 inch) pitch header; OC_FARNELL: 1125371; OC_NEWARK: unknown
X2 X5 = con-molex:53?-04: CONNECTOR wire to board 1.25 mm (.049 inch) pitch header; MF: WALDOM/MOLEX; MPN: 53047-0410; OC_FARNELL: 9733060; OC_NEWARK: 38C9900
X3 X6 = con-molex:53?-06: CONNECTOR wire to board 1.25 mm (.049 inch) pitch header; MPN: 53047-0610-C; OC_FARNELL: 9733078; OC_NEWARK: 03M2965
X4 = con-molex:53?-09: CONNECTOR wire to board 1.25 mm (.049 inch) pitch header; OC_FARNELL: unknown; OC_NEWARK: unknown
Y1 Y2 = microbuilder:CRYSTAL: Crystals HC49UP - Surface Mount Crystal 4.0MHz 18pF +/-30ppm Surface Mount Crystal [Digikey: 535-9857-1-ND] 12.0 MHz Surface Mount Crystal [Digikey: 535-9869-6-ND] 25.0 MHz Surface Mount Crystal [Digikey: 535-9078-1-ND] 2.5 x 2.0mm - MEMs SMT Crystal 16.0 MHz 10pF 20ppm 2.5 x 2.0mm Crystal [Digikey -40-85°C: 535-10923-1-ND] 3.2 x 2.5mm - MEMs SMT Crystal 12.0 MHz 8pF 15ppm 3.2 x 2.5mm Crystal [Digikey: -10-70°C: 644-1047-1-ND -40-125°C: 644-1128-1-ND] 16.0 MHz 8pF 15ppm 3.2 x 2.5mm Crystal [Digikey: -10-70°C: 644-1049-1-ND -40-125°C: 644-1129-2-ND] 16.0 MHz 10pF 10ppm 3.2 x 2.5mm Crystal [Digikey: 644-1100-1-ND] 27.12 MHz 18pF 30ppm 3.2 x 2.5mm Crystal [Digikey: 887-1424-1-ND] 27.12MHz 10pF 10ppm 3.2 x 2.5mm Crystal [Digikey: 887-1329-1-ND] 4.9 x 1.8mm - MEMs SMT Crystal 32.768 KHz 12.5pF 20ppm 4.9 x 1.8mm Crystal [Digikey: SE2415CT-ND] 8.0 x 3.8mm - Surface Mount Crystal 32.768kHz 12.5pF 20ppm -40°C-85°C [Digikey: 535-9166-2-ND] Cylinder 32.768KHz Cylinder Crystal (2x6mm body) [Ex. Digikey: 300-8341-2-ND]